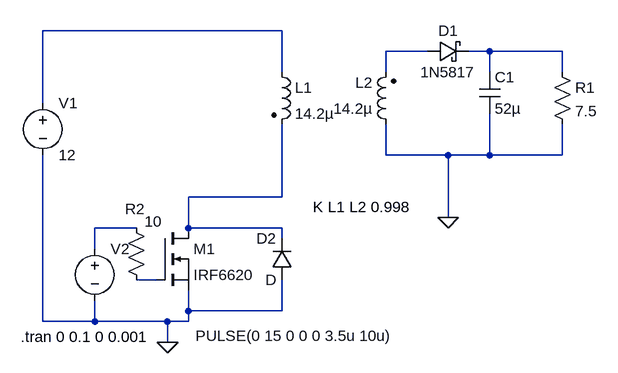
[diagram p0: schematic Draft1.asc]
Draft1.asc, the LTspice schematic file:
Version 4
SHEET 1 880 680
WIRE 128 64 -240 64
WIRE 352 96 288 96
WIRE 448 96 416 96
WIRE 560 96 448 96
WIRE 128 128 128 64
WIRE 288 128 288 96
WIRE 448 128 448 96
WIRE 560 128 560 96
WIRE -240 176 -240 64
WIRE 288 256 288 208
WIRE 384 256 288 256
WIRE 448 256 448 192
WIRE 448 256 384 256
WIRE 560 256 560 208
WIRE 560 256 448 256
WIRE 128 320 128 208
WIRE 128 320 -16 320
WIRE 384 352 384 256
WIRE -96 368 -160 368
WIRE -16 368 -16 320
WIRE 128 368 -16 368
WIRE 128 384 128 368
WIRE -160 400 -160 368
WIRE -64 448 -96 448
WIRE -16 496 -16 464
WIRE 128 496 128 448
WIRE 128 496 -16 496
WIRE -240 512 -240 256
WIRE -160 512 -160 480
WIRE -160 512 -240 512
WIRE -48 512 -160 512
WIRE -16 512 -16 496
WIRE -16 512 -48 512
WIRE -48 544 -48 512
FLAG 384 352 0
FLAG -48 544 0
SYMBOL ind2 112 112 R0
SYMATTR InstName L1
SYMATTR Value 14.2µ
SYMATTR Type ind
SYMBOL ind2 304 224 R180
WINDOW 0 36 80 Left 2
WINDOW 3 36 40 Left 2
SYMATTR InstName L2
SYMATTR Value 14.2µ
SYMATTR Type ind
SYMBOL schottky 352 112 R270
WINDOW 0 32 32 VTop 2
WINDOW 3 0 32 VBottom 2
SYMATTR InstName D1
SYMATTR Value 1N5817
SYMATTR Description Diode
SYMATTR Type diode
SYMBOL cap 432 128 R0
SYMATTR InstName C1
SYMATTR Value 52µ
SYMBOL res 544 112 R0
SYMATTR InstName R1
SYMATTR Value 7.5
SYMBOL voltage -240 160 R0
WINDOW 123 0 0 Left 0
WINDOW 39 0 0 Left 0
SYMATTR InstName V1
SYMATTR Value 12
SYMBOL voltage -160 384 R0
WINDOW 3 155 150 Left 2
WINDOW 123 0 0 Left 0
WINDOW 39 0 0 Left 0
SYMATTR InstName V2
SYMATTR Value PULSE(0 15 0 0 0 3.5u 10u)
SYMBOL nmos -64 368 R0
SYMATTR InstName M1
SYMATTR Value IRF6620
SYMBOL res -112 352 R0
WINDOW 0 -1 -13 Left 2
WINDOW 3 29 6 Left 2
SYMATTR InstName R2
SYMATTR Value 10
SYMBOL diode 144 448 R180
WINDOW 0 24 64 Left 2
WINDOW 3 24 0 Left 2
SYMATTR InstName D2
TEXT 176 336 Left 2 !K L1 L2 0.998
TEXT -274 536 Left 2 !.tran 0 0.1 0 0.001

The netlist it stands for:
* Draft1.asc
L1 N001 N004 14.2µ
L2 0 N002 14.2µ
D1 N002 N003 1N5817
C1 N003 0 52µ
R1 N003 0 7.5
V1 N001 0 12
V2 N005 0 PULSE(0 15 0 0 0 3.5u 10u)
M1 N004 N006 0 0 IRF6620
R2 N005 N006 10
D2 0 N004 D
.model D D
.lib standard.dio
.model NMOS NMOS
.model PMOS PMOS
.lib standard.mos
K L1 L2 0.998
.tran 0 0.1 0 0.001
.backanno
.end